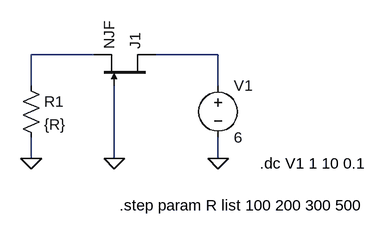
[diagram p0: schematic DC_Jfet.asc]
DC_Jfet.asc, the LTspice schematic file:
Version 4
SHEET 1 880 680
WIRE 128 144 32 144
WIRE 320 144 224 144
WIRE 32 192 32 144
WIRE 320 192 320 144
WIRE 32 304 32 272
WIRE 160 304 160 192
WIRE 320 304 320 272
FLAG 160 304 0
FLAG 320 304 0
FLAG 32 304 0
SYMBOL njf 224 192 M270
SYMATTR InstName J1
SYMBOL res 16 176 R0
SYMATTR InstName R1
SYMATTR Value {R}
SYMBOL voltage 320 176 R0
SYMATTR InstName V1
SYMATTR Value 6
TEXT 384 312 Left 2 !.dc V1 1 10 0.1
TEXT 168 376 Left 2 !.step param R list 100 200 300 500

The netlist it stands for:
* DC_Jfet.asc
J1 N002 0 N001 NJF
R1 N001 0 {R}
V1 N002 0 6
.model NJF NJF
.model PJF PJF
.lib standard.jft
.dc V1 1 10 0.1
.step param R list 100 200 300 500
.backanno
.end